# Altium schematic sheet LAB04.SchDoc
size A4; SheetNumber: 1; SheetTotal: 1
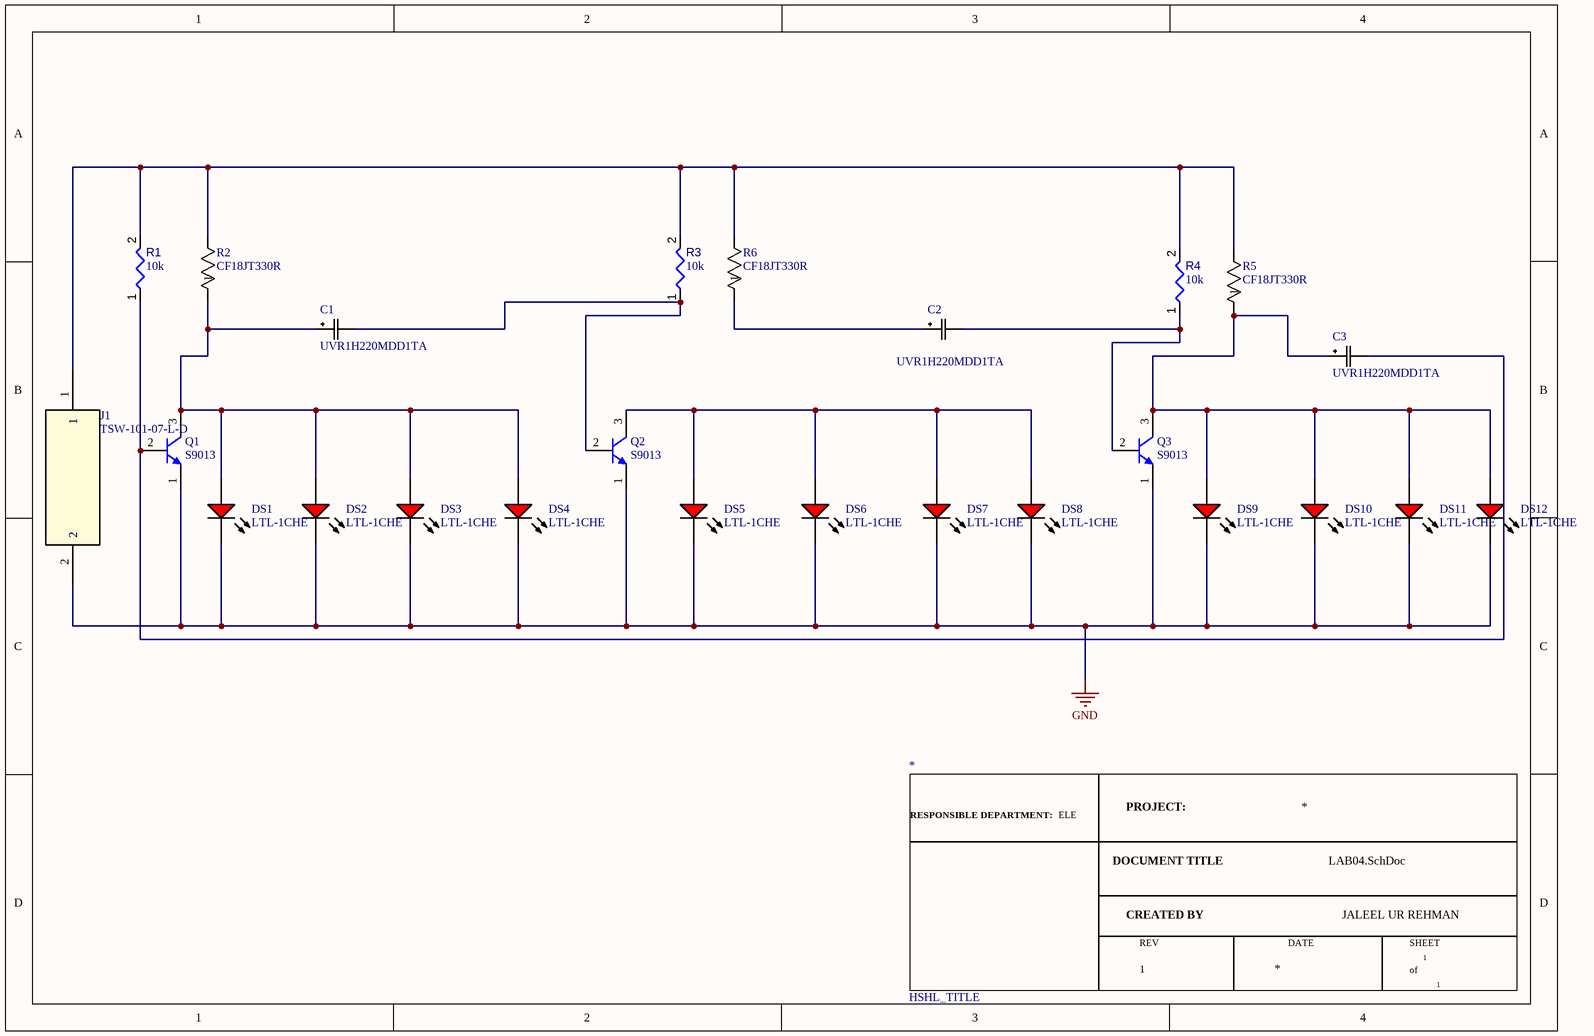
[diagram p0: LAB04.SchDoc]

## Parts
*  HSHL_TITLE  (graphical)
C1  UVR1H220MDD1TA  [CAP_UEP_5X11_NCH]
C2  UVR1H220MDD1TA  [CAP_UEP_5X11_NCH]
C3  UVR1H220MDD1TA  [CAP_UEP_5X11_NCH]
DS1  LTL-1CHE  [INDPR60-254-520X380X650]
DS2  LTL-1CHE  [INDPR60-254-520X380X650]
DS3  LTL-1CHE  [INDPR60-254-520X380X650]
DS4  LTL-1CHE  [INDPR60-254-520X380X650]
DS5  LTL-1CHE  [INDPR60-254-520X380X650]
DS6  LTL-1CHE  [INDPR60-254-520X380X650]
DS7  LTL-1CHE  [INDPR60-254-520X380X650]
DS8  LTL-1CHE  [INDPR60-254-520X380X650]
DS9  LTL-1CHE  [INDPR60-254-520X380X650]
DS10  LTL-1CHE  [INDPR60-254-520X380X650]
DS11  LTL-1CHE  [INDPR60-254-520X380X650]
DS12  LTL-1CHE  [INDPR60-254-520X380X650]
J1  TSW-101-07-L-D  [TSW-101-07-G-D_SAI]
Q1  S9013  [JSCJ-TO-92-3_V]
Q2  S9013  [JSCJ-TO-92-3_V]
Q3  S9013  [JSCJ-TO-92-3_V]
R1  value 10k  [RESA60-630X240]  (hidden comment: MFR-25FBF52-10K)
R2  CF18JT330R  [STA_CF18_STP]
R3  value 10k  [RESA60-630X240]  (hidden comment: MFR-25FBF52-10K)
R4  value 10k  [RESA60-630X240]  (hidden comment: MFR-25FBF52-10K)
R5  CF18JT330R  [STA_CF18_STP]
R6  CF18JT330R  [STA_CF18_STP]

## Nets
GND: DS1.2(K) DS2.2(K) DS3.2(K) DS4.2(K) DS5.2(K) DS6.2(K) DS7.2(K) DS8.2(K) DS9.2(K) DS10.2(K) DS11.2(K) DS12.2(K) J1.2 Q1.1(E) Q2.1(E) Q3.1(E)
NetC1_1: C1.1 DS1.1(A) DS2.1(A) DS3.1(A) DS4.1(A) Q1.3(C) R2.1
NetC1_2: C1.2 Q2.2(B) R3.1
NetC2_1: C2.1 R6.1
NetC2_2: C2.2 Q3.2(B) R4.1
NetC3_1: C3.1 DS9.1(A) DS10.1(A) DS11.1(A) DS12.1(A) Q3.3(C) R5.1
NetC3_2: C3.2 Q1.2(B) R1.1
NetDS5_1: DS5.1(A) DS6.1(A) DS7.1(A) DS8.1(A) Q2.3(C)
NetJ1_1: J1.1 R1.2 R2.2 R3.2 R4.2 R5.2 R6.2

## Notes on the sheet
- (in symbol HSHL_TITLE) RESPONSIBLE DEPARTMENT:; ELE; PROJECT:; DOCUMENT TITLE; CREATED BY; JALEEL UR REHMAN; REV; DATE; SHEET; 1; of

## Library data of the parts
C1-C3 = UVR1H220MDD1TA: No Description Available; Manufacturer_Name: Nichicon; Copyright: Copyright (C) 2026 Ultra Librarian. All rights reserved.; Manufacturer_Part_Number: UVR1H220MDD1TA
DS1-DS12 = CMP-007-00018-2: LED Uni-Color Red, 100 mW, 30 mA, -55 to 100 degC, 2-Pin THD, RoHS, Bulk; Manufacturer: Lite-On; Forward Current: 20mA; Nominal Vf: 2V; Viewing Angle: 60degrees; Luminous Intensity: 12.6mcd; Lens Style: Dome; Pins: 2; RoHS Compliant: True; Package Reference: LTL-1CHE; Package Quantity: 1000; Mounting Technology: TH; Min Operating Temperature: -55°C; Colour: Red; Case/Package: Radial; Manufacturer URL: http://www.us.liteon.com/; Datasheet URL: https://datasheet.ciiva.com/15117/getdatasheetpartid-187746-15117985.pdf; Forward Voltage: 2V; Max Operating Temperature: 100°C; Illumination Colour: Red; Package Description: 2-Pin Through Hole Device, Dia 3.8 mm, Pitch 2.54 mm; Packaging: Bulk; Datasheet Version: Dec-03
J1 = TSW-101-07-L-D: Description; Manufacturer_Name: Samtec Inc; Copyright: Copyright (C) 2026 Ultra Librarian. All rights reserved.; Manufacturer_Part_Number: TSW-101-07-L-D; RefDes: RefDes; Type: Type
Q1-Q3 = CMP-013-00000-3: Transistor, NPN, 0.1 uA, 150 MHz, 3-Pin TO-92; Manufacturer: Jiangsu Changjiang Electronics Technology; Case/Package: TO-92-3; Datasheet URL: http://www.cj-elec.com/txUpfile/20121910315050632.pdf; Datasheet Version: Rev. B, 11/2011; Package Description: 3-Pin Through Hole Device, Height 4.7 mm, Pitch 2.3 mm; Mounting Technology: TH; RoHS Compliant: False; Package Reference: TO-92-3
R1 R3 R4 = CMP-009-00047-4: Axial Resistor, 10 KOhm, +/- 1%, 0.25 W, -55 to 155 degC, 2-Pin THD, RoHS, Bulk; Manufacturer: Yageo; Power: 250mW; Voltage Rating: 250V; Manufacturer URL: http://www.yageo.com/; Datasheet URL: http://www.yageo.com/documents/recent/Yageo%20LR_MFR_2013.pdf; Package Reference: MFR-25; Min Operating Temperature: -55°C; Mounting Technology: TH; Package Quantity: 200; Case/Package: Axial; Tolerance: 1%; RoHS Compliant: True; Datasheet Version: Apr-13; Packaging: Bulk; Max Operating Temperature: 155°C; Package Description: 2-Pin Axial Lead, Dia 2.4 mm, Body Length 6.3 mm
R2 R5 R6 = CF18JT330R: Description; Manufacturer_Name: Stackpole International; Copyright: Copyright (C) 2025 Ultra Librarian. All rights reserved.; Manufacturer_Part_Number: CF18JT330R